# EAGLE design ABMS - VFG - CONTROL (EAGLE 5.10)
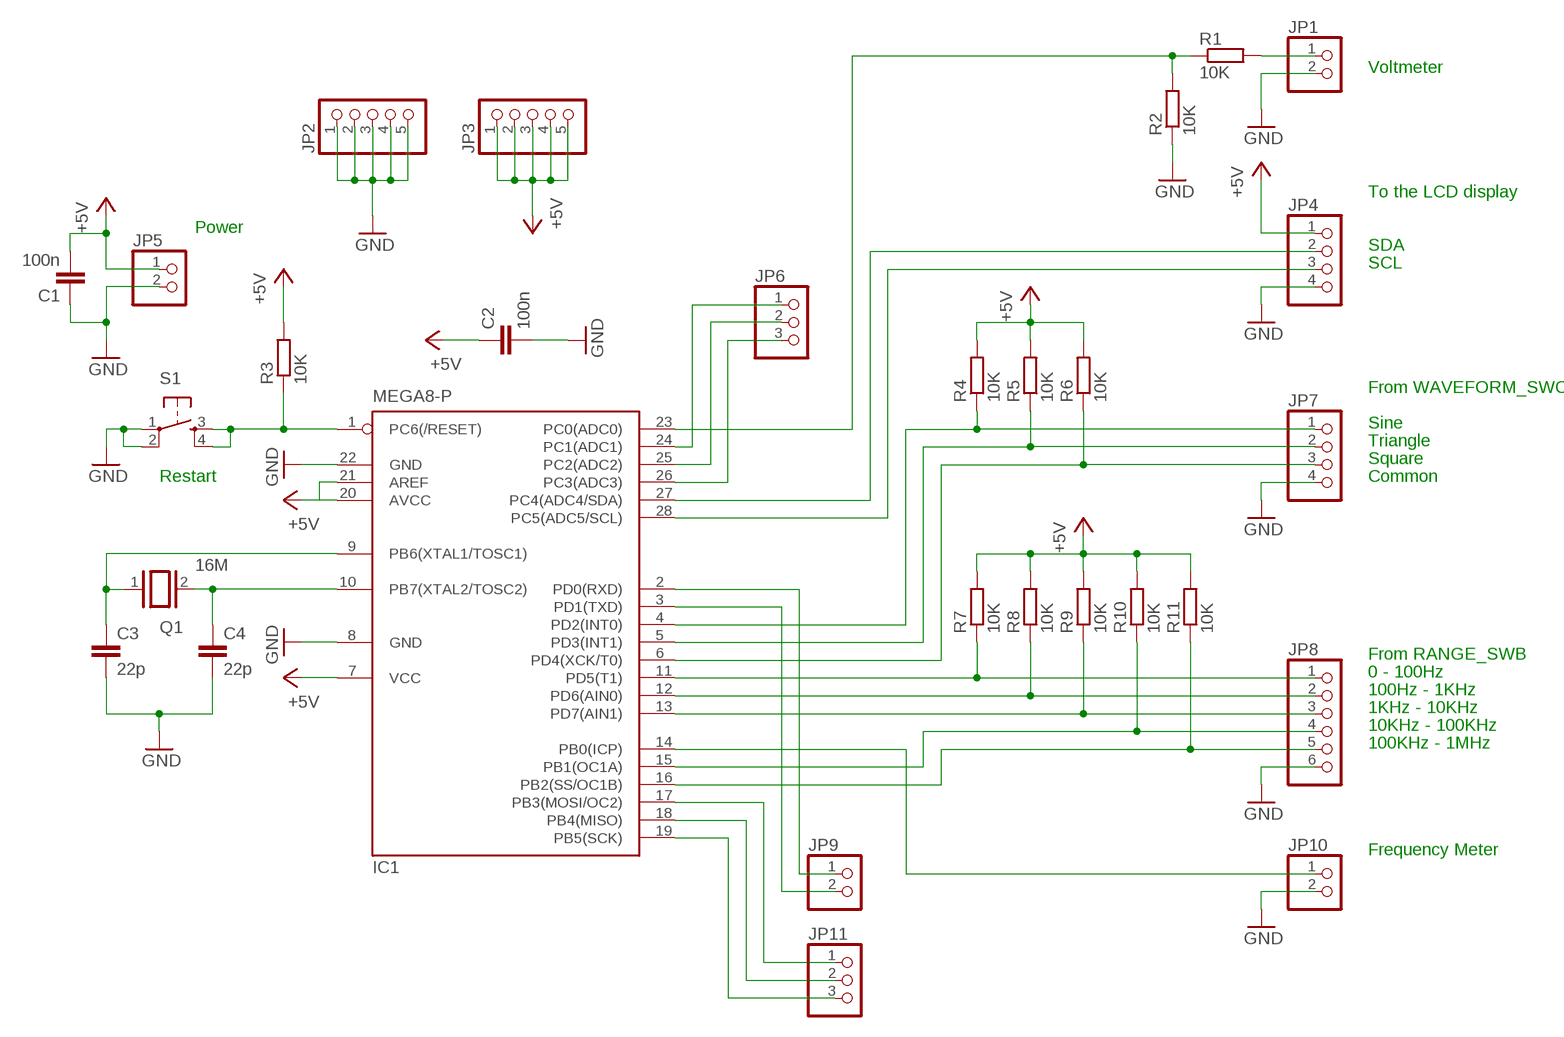
[diagram p0: schematic, sheet 1]

## Parts
C1  100n  C-EU075-032X103  [C075-032X103]
C2  100n  C-EU075-032X103  [C075-032X103]
C3  22p  C-EU050-025X075  [C050-025X075]
C4  22p  C-EU050-025X075  [C050-025X075]
IC1  MEGA8-P  [DIL28-3]
JP1  PINHD-1X2  [1X02]
JP2  PINHD-1X5  [1X05]
JP3  PINHD-1X5  [1X05]
JP4  PINHD-1X4  [1X04]
JP5  PINHD-1X2  [1X02]
JP6  PINHD-1X3  [1X03]
JP7  PINHD-1X4  [1X04]
JP8  PINHD-1X6  [1X06]
JP9  PINHD-1X2  [1X02]
JP10  PINHD-1X2  [1X02]
JP11  PINHD-1X3  [1X03]
Q1  16M  XTAL/S  [QS]
R1  10K  R-EU_0204/7  [0204/7]
R2  10K  R-EU_0204/7  [0204/7]
R3  10K  R-EU_0204/7  [0204/7]
R4  10K  R-EU_0204/7  [0204/7]
R5  10K  R-EU_0204/7  [0204/7]
R6  10K  R-EU_0204/7  [0204/7]
R7  10K  R-EU_0204/7  [0204/7]
R8  10K  R-EU_0204/7  [0204/7]
R9  10K  R-EU_0204/7  [0204/7]
R10  10K  R-EU_0204/7  [0204/7]
R11  10K  R-EU_0204/7  [0204/7]
S1  TAC_SWITCHPTH  [TACTILE-PTH]

## Nets
+5V: C1.2 C2.1 IC1.7(VCC) IC1.20(AVCC) IC1.21(AREF) JP3.1 JP3.2 JP3.3 JP3.4 JP3.5 JP4.1 JP5.1 R3.2 R4.2 R5.2 R6.2 R7.2 R8.2 R9.2 R10.2 R11.2
GND: C1.1 C2.2 C3.2 C4.2 IC1.8(GND) IC1.22(GND) JP1.2 JP2.1 JP2.2 JP2.3 JP2.4 JP2.5 JP4.4 JP5.2 JP7.4 JP8.6 JP10.2 R2.1 S1.1 S1.2
N$1: IC1.4(PD2(INT0)) JP7.1 R4.1
N$2: IC1.5(PD3(INT1)) JP7.2 R5.1
N$3: IC1.1(PC6(/RESET)) R3.1 S1.3 S1.4
N$4: IC1.6(PD4(XCK/T0)) JP7.3 R6.1
N$5: IC1.23(PC0(ADC0)) R1.1 R2.2
N$6: JP1.1 R1.2
N$7: IC1.11(PD5(T1)) JP8.1 R7.1
N$8: C4.1 IC1.10(PB7(XTAL2/TOSC2)) Q1.2
N$9: C3.1 IC1.9(PB6(XTAL1/TOSC1)) Q1.1
N$10: IC1.12(PD6(AIN0)) JP8.2 R8.1
N$11: IC1.13(PD7(AIN1)) JP8.3 R9.1
N$12: IC1.15(PB1(OC1A)) JP8.4 R10.1
N$13: IC1.16(PB2(SS/OC1B)) JP8.5 R11.1
N$14: IC1.24(PC1(ADC1)) JP6.1
N$15: IC1.25(PC2(ADC2)) JP6.2
N$16: IC1.14(PB0(ICP)) JP10.1
N$17: IC1.26(PC3(ADC3)) JP6.3
N$18: IC1.2(PD0(RXD)) JP9.1
N$19: IC1.3(PD1(TXD)) JP9.2
N$20: IC1.28(PC5(ADC5/SCL)) JP4.3
N$21: IC1.27(PC4(ADC4/SDA)) JP4.2
N$22: IC1.17(PB3(MOSI/OC2)) JP11.1
N$23: IC1.18(PB4(MISO)) JP11.2
N$24: IC1.19(PB5(SCK)) JP11.3

## Notes on the sheet
- Voltmeter
- To the LCD display
- Power
- SDA
- SCL
- From WAVEFORM_SWC
- Sine
- Triangle
- Square
- Restart | Common
- From RANGE_SWB
- 0 - 100Hz
- 100Hz - 1KHz
- 1KHz - 10KHz
- 10KHz - 100KHz
- 100KHz - 1MHz
- Frequency Meter

## Library data of the parts
C1-C4 = resistor:C-EU: CAPACITOR, European symbol
IC1 = atmel:MEGA8-P: MICROCONTROLLER 8 Kbytes FLASH, 1 kbytes SRAM, 512 bytes EEPROM, USART, 4-channel 10 bit ADC, 2-channel 8 bit ADC Pin compatible with Atmega48, ATMega88, ATMega168 Source: avr.lbr
JP1 JP5 JP9 JP10 = pinhead:PINHD-1X2: PIN HEADER
JP2 JP3 = pinhead:PINHD-1X5: PIN HEADER
JP4 JP7 = pinhead:PINHD-1X4: PIN HEADER
JP6 JP11 = pinhead:PINHD-1X3: PIN HEADER
JP8 = pinhead:PINHD-1X6: PIN HEADER
Q1 = special:XTAL/S: CRYSTAL
R1-R11 = resistor:R-EU_: RESISTOR, European symbol
S1 = SparkFun:TAC_SWITCH: Momentary Switch Button commonly used for reset or general input. Spark Fun Electronics SKU : COM-00097

## Net classes
0 default: width 0.508 mm, drill 0.762 mm, clearance 0.508 mm

## Board
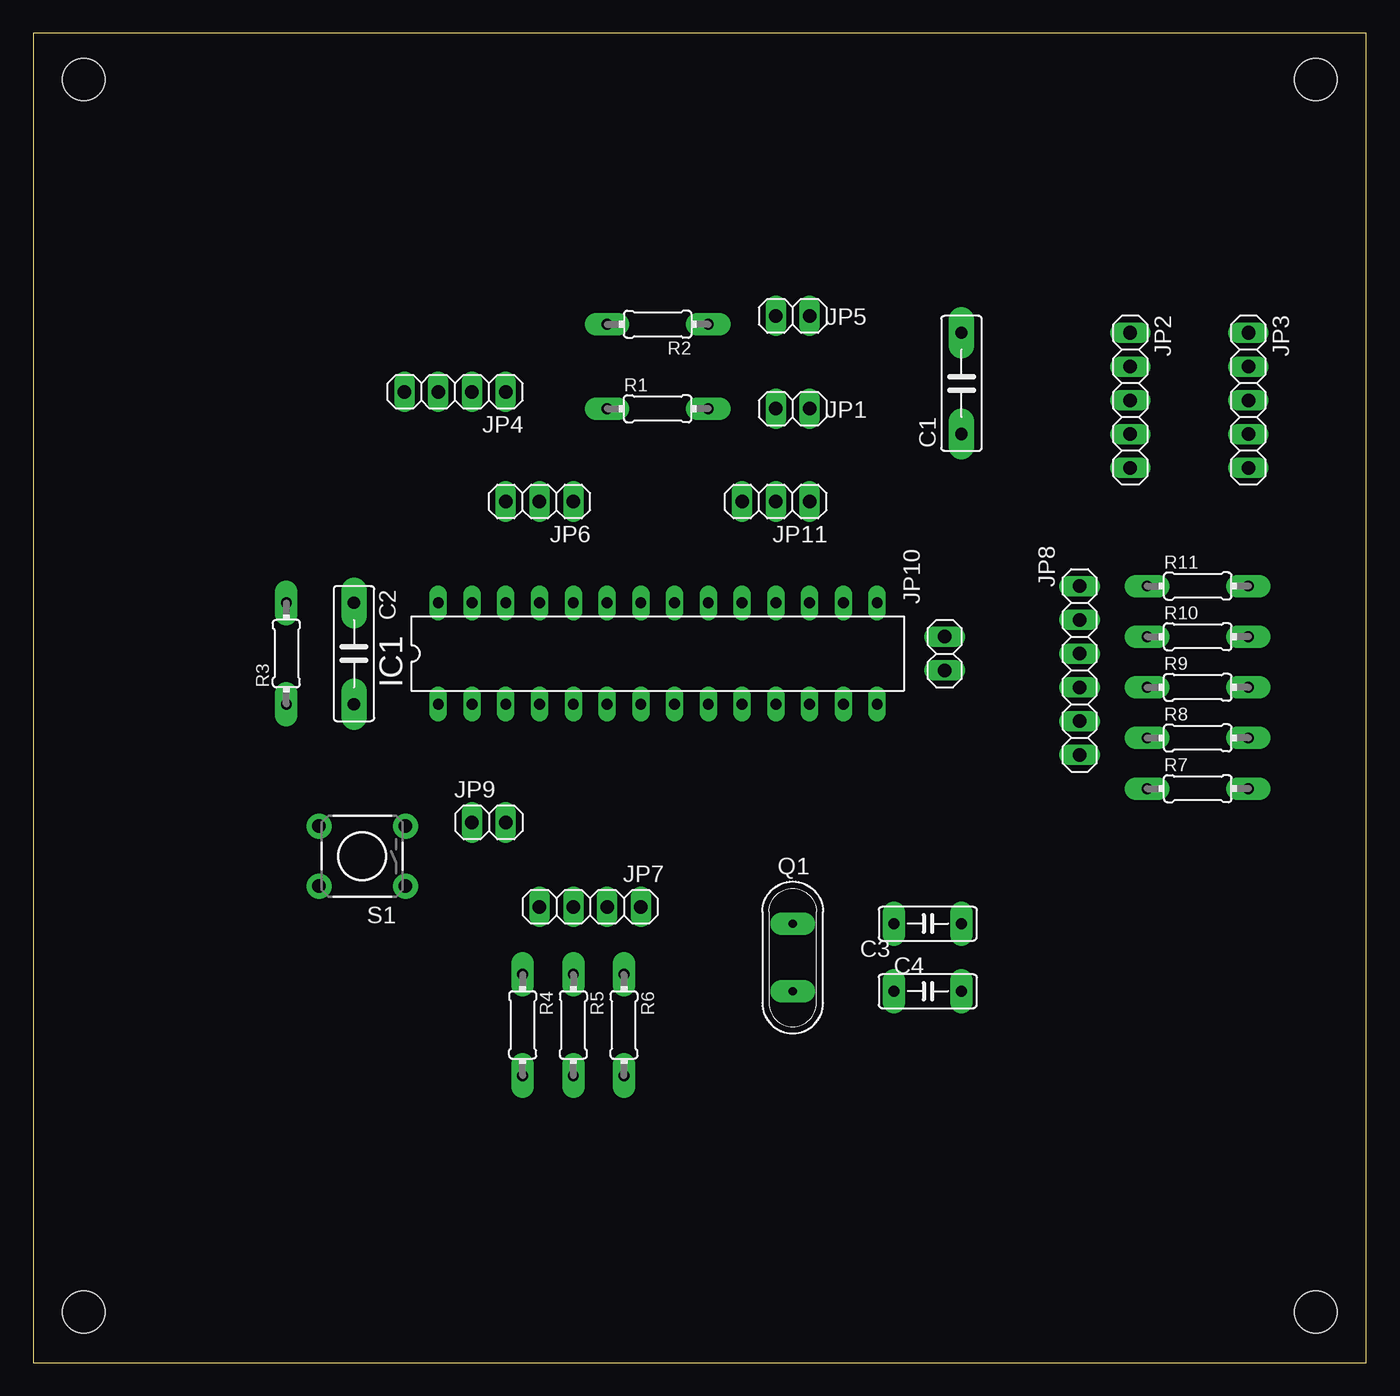
[diagram p1: board, top side]
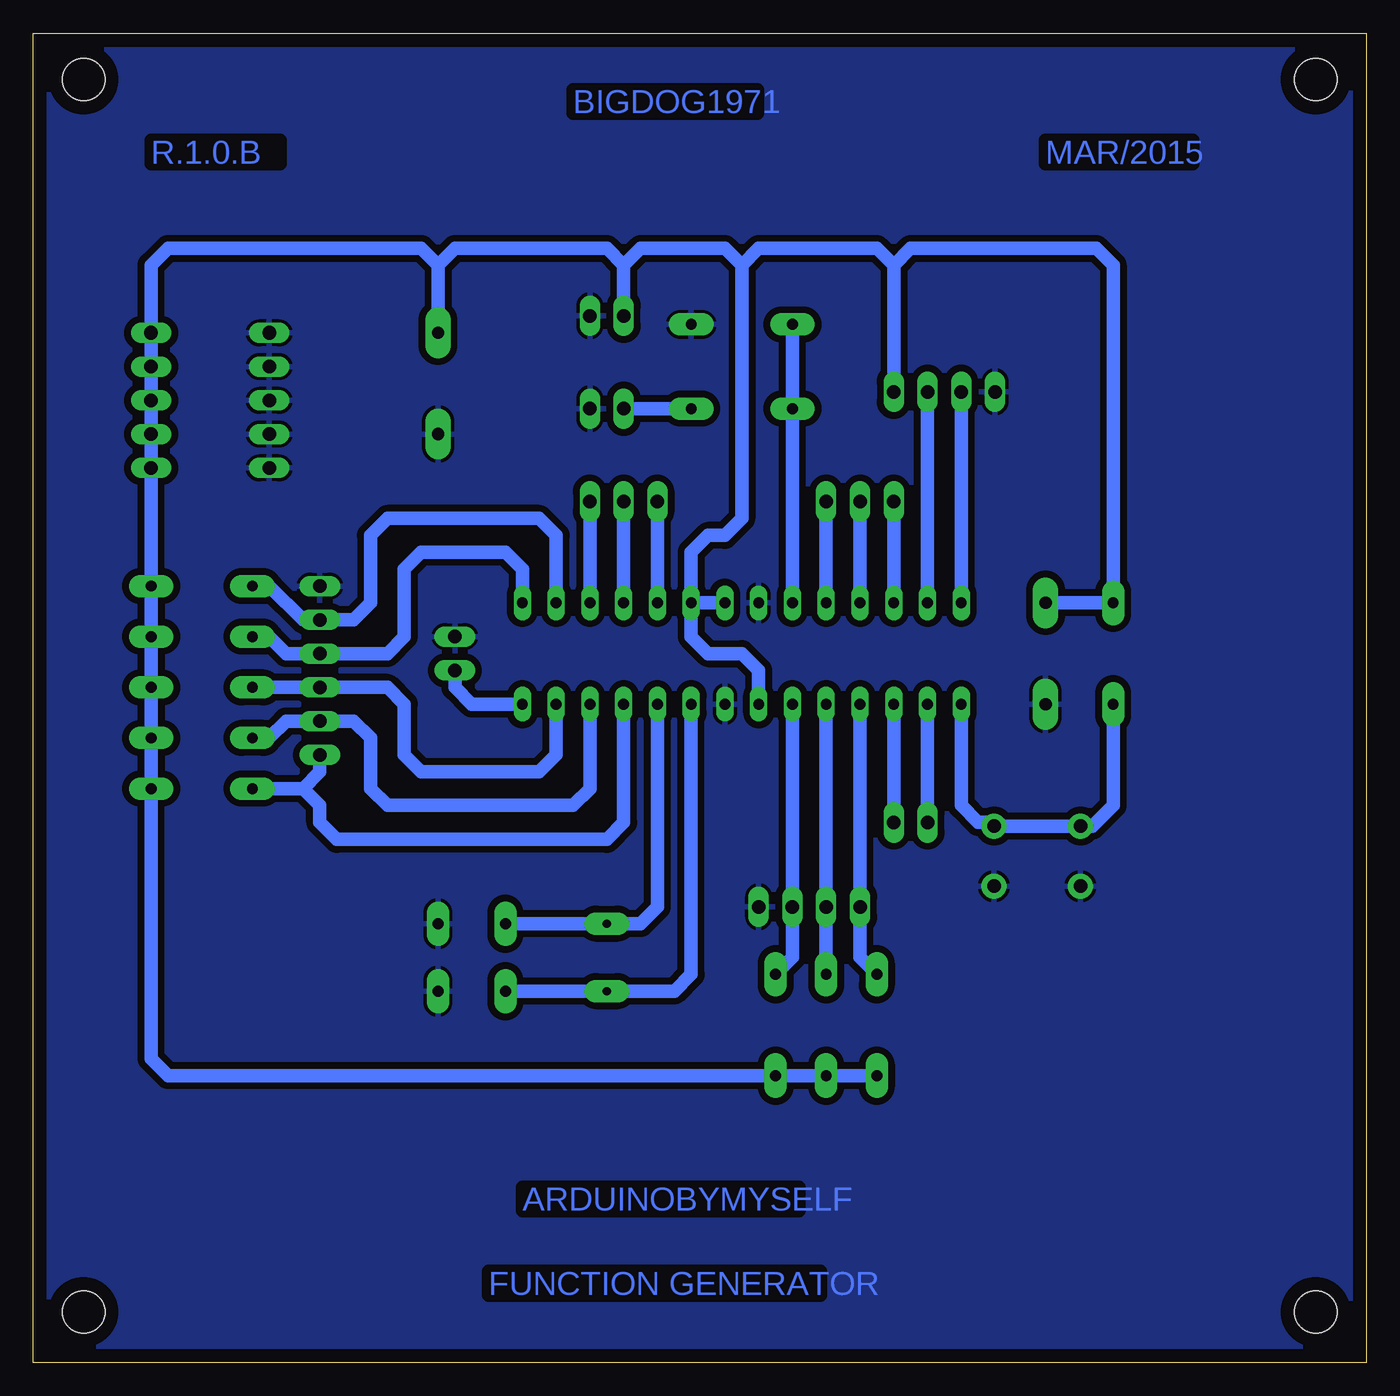
[diagram p2: board, bottom side, seen from below]

Size 100.31 x 100 mm. Coordinates in mm from the lower left corner, seen from the top.
Outline: 0,0 100.31,0 100.31,100 0,100 0,0
Copper layers (1*16): Top 0.035mm / dielectric 1.5mm / Bottom 0.035mm
Design rules "default": minimum track width 10mil, minimum drill 24mil, track to track 8mil, track to pad 8mil, pad to pad 8mil, via to via 8mil, smd to smd 8mil, copper to edge 40mil, drill to drill 8mil, minimum pad ring 10mil, minimum via ring 8mil, stop-mask expansion 4mil, vias tented up to drill 0mil, thermal gap 10mil
Holes 3.2 mm at 96.52,96.52 3.81,96.52 3.81,3.81 96.52,3.81

### Footprints (pad centres in the part's own frame; a part is rotated, then mirrored left to right if it is on the bottom)
C075-032X103 = drill 0.914 pad 1.93 long: 1 -3.81,0; 2 3.81,0
C050-025X075 = drill 0.813 pad 1.676 long: 1 -2.54,0; 2 2.54,0
DIL28-3 = drill 0.813 long: 1 -16.51,-3.81; 2 -13.97,-3.81; 3 -11.43,-3.81; 4 -8.89,-3.81; 5 -6.35,-3.81; 6 -3.81,-3.81; 7 -1.27,-3.81; 8 1.27,-3.81; 9 3.81,-3.81; 10 6.35,-3.81; 11 8.89,-3.81; 12 11.43,-3.81; 13 13.97,-3.81; 14 16.51,-3.81; 15 16.51,3.81; 16 13.97,3.81; 17 11.43,3.81; 18 8.89,3.81; 19 6.35,3.81; 20 3.81,3.81; 21 1.27,3.81; 22 -1.27,3.81; 23 -3.81,3.81; 24 -6.35,3.81; 25 -8.89,3.81; 26 -11.43,3.81; 27 -13.97,3.81; 28 -16.51,3.81
1X02 = drill 1.016 long: 1 -1.27,0; 2 1.27,0
1X05 = drill 1.016 long: 1 -5.08,0; 2 -2.54,0; 3 0,0; 4 2.54,0; 5 5.08,0
1X04 = drill 1.016 long: 1 -3.81,0; 2 -1.27,0; 3 1.27,0; 4 3.81,0
1X03 = drill 1.016 long: 1 -2.54,0; 2 0,0; 3 2.54,0
1X06 = drill 1.016 long: 1 -6.35,0; 2 -3.81,0; 3 -1.27,0; 4 1.27,0; 5 3.81,0; 6 6.35,0
QS = drill 0.61 pad 1.676 long: 1 -2.54,0; 2 2.54,0
0204/7 = drill 0.813 pad 1.676 long: 1 -3.81,0; 2 3.81,0
TACTILE-PTH = drill 1.016 pad 1.88 round: 1 -3.251,2.261; 2 3.251,2.261; 3 -3.251,-2.261; 4 3.251,-2.261

### Placement (x,y rotation side)
C1  69.85,73.66 90 top
C2  24.13,53.34 270 top
C3  67.31,27.94 0 top
C4  67.31,33.02 0 top
IC1  46.99,53.34 0 top
JP1  57.15,71.75 0 top
JP2  82.55,72.39 270 top
JP3  91.44,72.39 270 top
JP4  31.75,73.03 180 top
JP5  57.15,78.74 0 top
JP6  38.1,64.77 180 top
JP7  41.91,34.29 0 top
JP8  78.74,52.07 90 top
JP9  34.29,40.64 0 top
JP10  68.58,53.34 90 top
JP11  55.88,64.77 180 top
Q1  57.15,30.48 90 top
R1  46.99,71.75 0 top
R2  46.99,78.11 180 top
R3  19.05,53.34 90 top
R4  36.83,25.4 270 top
R5  40.64,25.4 270 top
R6  44.45,25.4 270 top
R7  87.63,43.18 0 top
R8  87.63,46.99 0 top
R9  87.63,50.8 0 top
R10  87.63,54.61 0 top
R11  87.63,58.42 0 top
S1  24.77,38.1 180 top

### Tracks (layer width: path | path; a pad name or v marks a point on that pad's centre or on a via)
+5V
  Bottom 1.016: C2.1 R3.2 19.05,82.55 20.32,83.82 34.29,83.82 35.56,82.55 | R4.2 R5.2 R6.2 90.17,21.59 91.44,22.86 R11.2 | R11.2 R10.2 R9.2 R8.2 R7.2 | R11.2 JP3.5 JP3.4 JP3.3 JP3.2 JP3.1 91.44,82.55 90.17,83.82 71.12,83.82 69.85,82.55 | IC1.7 45.72,52.07 46.99,53.34 49.53,53.34 50.8,54.61 IC1.20 | 55.88,82.55 57.15,83.82 68.58,83.82 69.85,82.55 | 55.88,82.55 JP5.1 | 55.88,82.55 54.61,83.82 48.26,83.82 46.99,82.55 | 46.99,82.55 46.99,63.5 48.26,62.23 49.53,62.23 50.8,60.96 IC1.20 | 35.56,82.55 36.83,83.82 45.72,83.82 46.99,82.55 | 35.56,82.55 JP4.1 | 69.85,82.55 C1.2 | IC1.20 IC1.21
GND
  pour Bottom: -1.27,100.97 101.6,100.97 101.6,-1.27 -1.27,-1.27
N$1
  Bottom 1.016: IC1.4 JP7.1 38.1,30.48 R4.1
N$2
  Bottom 1.016: IC1.5 JP7.2 R5.1
N$3
  Bottom 1.016: IC1.1 30.48,41.91 29.21,40.64 28.3,40.64 S1.3 S1.4 20.6,40.36 19.05,41.91 R3.1
N$4
  Bottom 1.016: IC1.6 JP7.3 43.18,30.48 R6.1
N$5
  Bottom 1.016: IC1.23 R1.1 R2.2
N$6
  Bottom 1.016: R1.2 JP1.1
N$7
  Bottom 1.016: JP8.1 78.74,44.45 80.01,43.18 | 80.01,43.18 R7.1 | IC1.11 55.88,40.64 57.15,39.37 77.47,39.37 78.74,40.64 78.74,41.91 80.01,43.18
N$8
  Bottom 1.016: IC1.10 53.34,34.29 54.61,33.02 Q1.2 C4.1
N$9
  Bottom 1.016: IC1.9 50.8,29.21 52.07,27.94 Q1.1 C3.1
N$10
  Bottom 1.016: R8.1 82.55,46.99 81.28,48.26 JP8.2 76.2,48.26 74.93,46.99 74.93,43.18 73.66,41.91 59.69,41.91 58.42,43.18 IC1.12
N$11
  Bottom 1.016: R9.1 JP8.3 73.66,50.8 72.39,49.53 72.39,45.72 71.12,44.45 62.23,44.45 60.96,45.72 IC1.13
N$12
  Bottom 1.016: R10.1 82.55,54.61 81.28,53.34 JP8.4 73.66,53.34 72.39,54.61 72.39,59.69 71.12,60.96 64.77,60.96 63.5,59.69 IC1.15
N$13
  Bottom 1.016: R11.1 82.55,58.42 80.01,55.88 JP8.5 76.2,55.88 74.93,57.15 74.93,62.23 73.66,63.5 62.23,63.5 60.96,62.23 IC1.16
N$14
  Bottom 1.016: IC1.24 JP6.1
N$15
  Bottom 1.016: IC1.25 JP6.2
N$16
  Bottom 1.016: IC1.14 67.31,49.53 68.58,50.8 JP10.1
N$17
  Bottom 1.016: IC1.26 JP6.3
N$18
  Bottom 1.016: JP9.1 IC1.2
N$19
  Bottom 1.016: JP9.2 IC1.3
N$20
  Bottom 1.016: IC1.28 JP4.3
N$21
  Bottom 1.016: IC1.27 JP4.2
N$22
  Bottom 1.016: IC1.17 JP11.1
N$23
  Bottom 1.016: IC1.18 JP11.2
N$24
  Bottom 1.016: IC1.19 JP11.3

### Text on the board
Bottom: BIGDOG1971 | MAR/2015 | R.1.0.B | ARDUINOBYMYSELF | FUNCTION GENERATOR